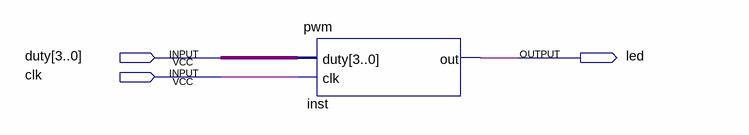
[diagram p0: schematic sheet]
// Quartus schematic Lab4_2.bdf as structural Verilog: 1 symbols, 3 pins
module Lab4_2 (
  input  [3:0] duty,
  input  clk,
  output led
);

  pwm inst (.duty(duty), .clk(clk), .out(led));
endmodule
